# Altium schematic sheet [X] - mPCIe CONN.SchDoc
size 513 x 386 mm
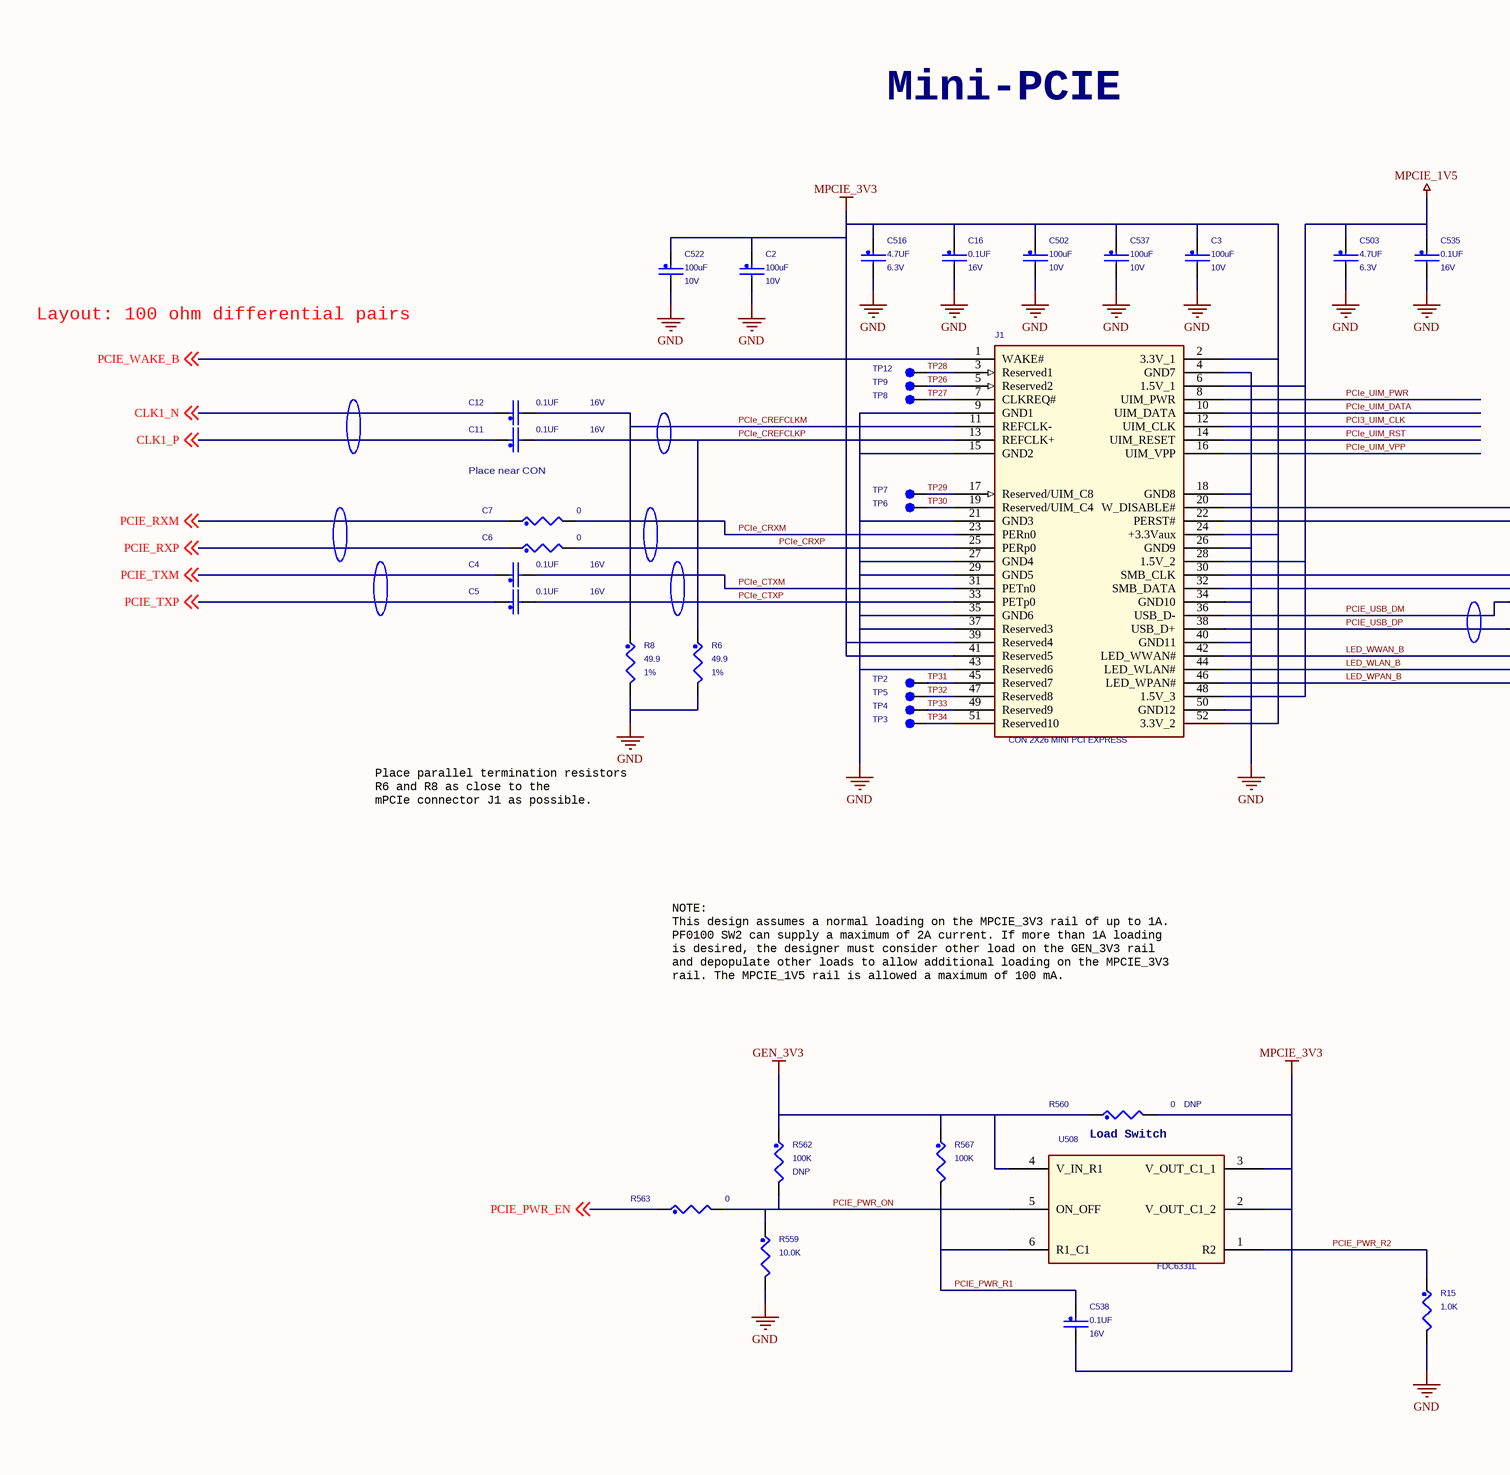
[diagram p0: [X] - mPCIe CONN.SchDoc, left]
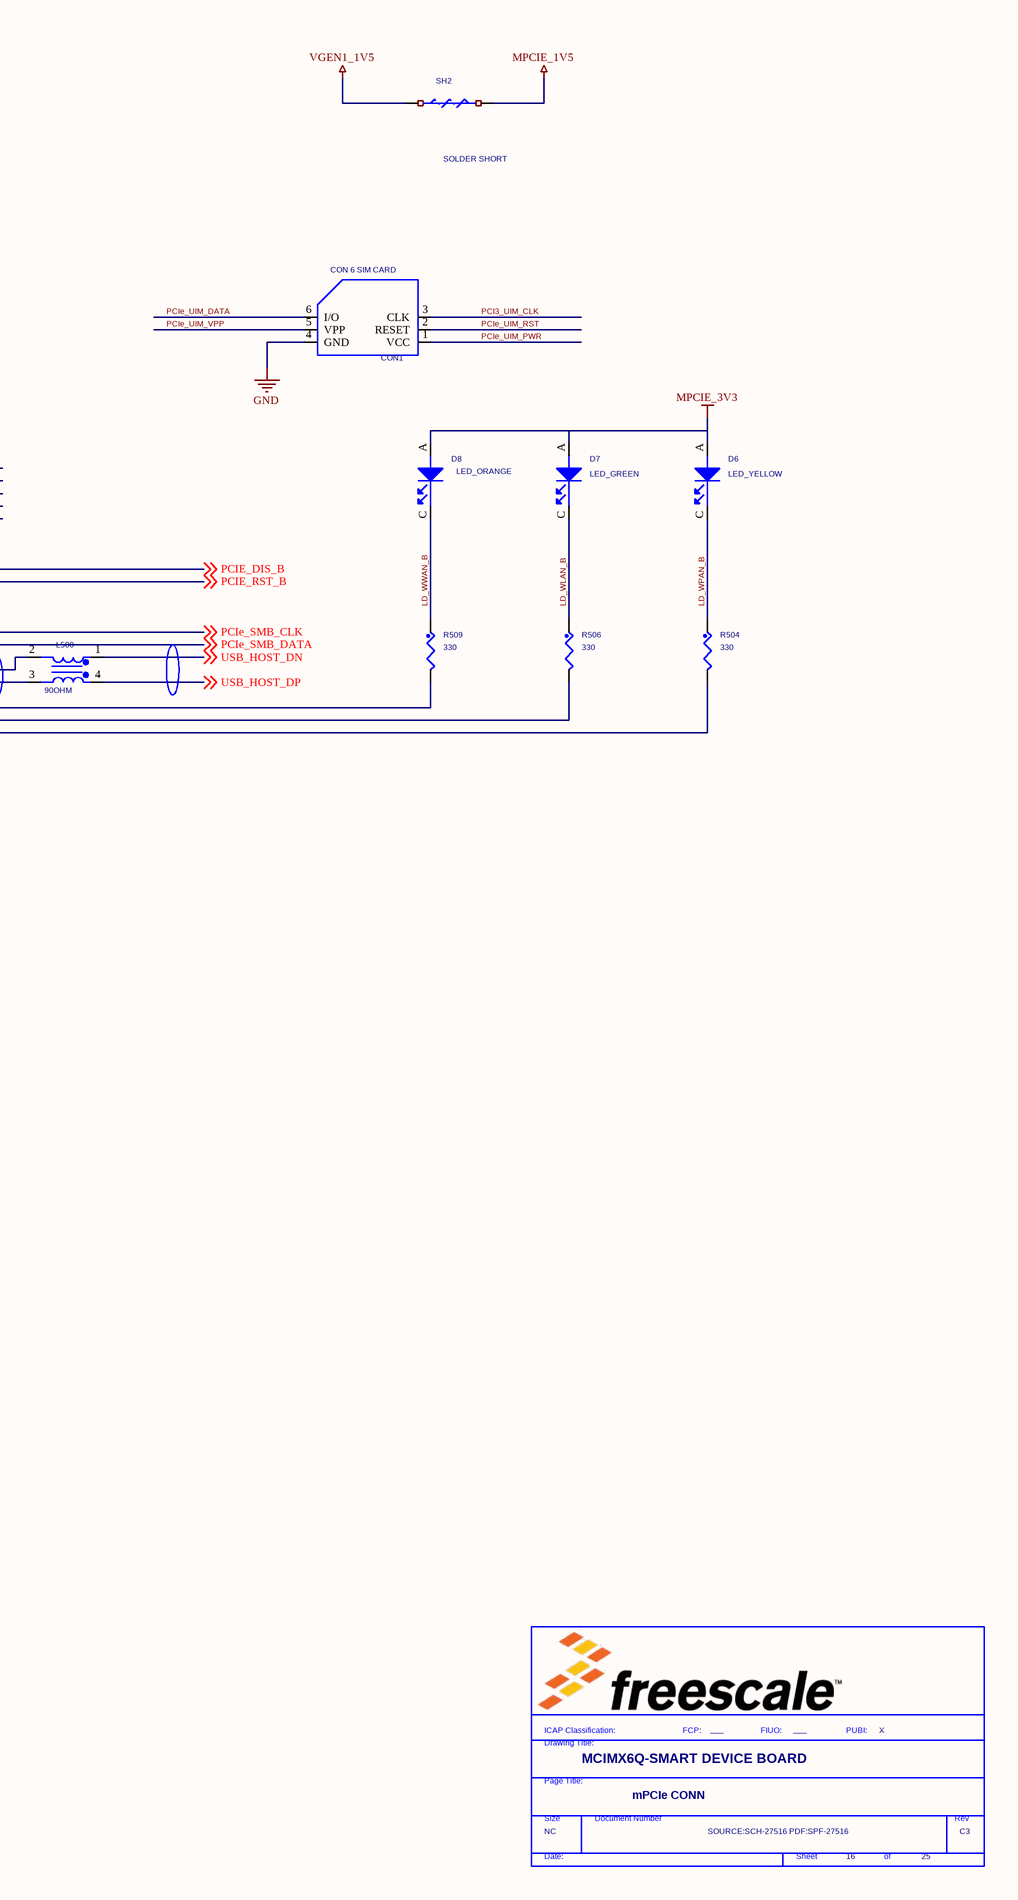
[diagram p1: [X] - mPCIe CONN.SchDoc, right]

## Parts
*  FIUO: ___  PUBI: X  Doc: SOURCE:SCH-27516 PDF:SPF-27516  RevCode: C3  Title: MCIMX6Q-SMART DEVICE BOARD  Page Size: NC  Page Number: 16  Page Count: 25  PageTitle: mPCIe CONN  (hidden comment: TitleBlock_FS)  (graphical)
C2  100uF  WVDC: 10V  [1206_CC]
C3  100uF  WVDC: 10V  [1206_CC]
C4  0.1UF  WVDC: 16V  [0402_CC]
C5  0.1UF  WVDC: 16V  [0402_CC]
C6  0  [0402_CC]
C7  0  [0402_CC]
C11  0.1UF  WVDC: 16V  [0402_CC]
C12  0.1UF  WVDC: 16V  [0402_CC]
C16  0.1UF  WVDC: 16V  [0402_CC]
C502  100uF  WVDC: 10V  [1206_CC]
C503  4.7UF  WVDC: 6.3V  [0603_CC]
C516  4.7UF  WVDC: 6.3V  [0603_CC]
C522  100uF  WVDC: 10V  [1206_CC]
C535  0.1UF  WVDC: 16V  [0402_CC]
C537  100uF  WVDC: 10V  [1206_CC]
C538  0.1UF  WVDC: 16V  [0402_CC]
CON1  CON 6 SIM CARD  [con_sim_cd_2p54mm]
D6  LED_YELLOW  [LED_0603]
D7  LED_GREEN  [LED_0603]
D8  LED_ORANGE  [LED_0603]
J1  CON 2X26 MINI PCI EXPRESS  [con_2x26_0p8_smt_a]
L500  90OHM  [ind4_choke_0805]
R6  49.9  Tolerance: 1%  [0402_CC]
R8  49.9  Tolerance: 1%  [0402_CC]
R15  1.0K  [0402_CC]
R504  330  [0402_CC]
R506  330  [0402_CC]
R509  330  [0402_CC]
R559  10.0K  [0402_CC]
R560  0  ASSY_OPT: DNP  [0402_CC]
R562  100K  ASSY_OPT: DNP  [0402_CC]
R563  0  [0402_CC]
R567  100K  [0402_CC]
SH2  SOLDER SHORT  [SH0805_40]
TP2  TEST POINT  [C035S]  (value not drawn)
TP3  TEST POINT  [C035S]  (value not drawn)
TP4  TEST POINT  [C035S]  (value not drawn)
TP5  TEST POINT  [C035S]  (value not drawn)
TP6  TEST POINT  [C035S]  (value not drawn)
TP7  TEST POINT  [C035S]  (value not drawn)
TP8  TEST POINT  [C035S]  (value not drawn)
TP9  TEST POINT  [C035S]  (value not drawn)
TP12  TEST POINT  [C035S]  (value not drawn)
U508  FDC6331L  [ssot6_1p7x3]

## Nets
GEN_3V3: R560.1 R562.1 R567.1 U508.4(V_IN_R1)
GND: C2.2 C3.2 C16.2 C502.2 C503.2 C516.2 C522.2 C535.2 C537.2 CON1.4(GND) J1.4(GND7) J1.9(GND1) J1.15(GND2) J1.18(GND8) J1.21(GND3) J1.26(GND9) J1.27(GND4) J1.29(GND5) J1.34(GND10) J1.35(GND6) J1.37(Reserved3) J1.40(GND11) J1.43(Reserved6) J1.50(GND12) R6.2 R8.2 R15.2 R559.2
MPCIE_1V5: C503.1 C535.1 J1.6(1.5V_1) J1.28(1.5V_2) J1.48(1.5V_3) SH2.2
MPCIE_3V3: C2.1 C3.1 C16.1 C502.1 C516.1 C522.1 C537.1 C538.2 D6.A(ANODE) D7.A(ANODE) D8.A(ANODE) J1.2(3.3V_1) J1.24(+3.3Vaux) J1.39(Reserved4) J1.41(Reserved5) J1.52(3.3V_2) R560.2 U508.2(V_OUT_C1_2) U508.3(V_OUT_C1_1)
VGEN1_1V5: SH2.1
CLK1_N: C12.1 ; off-sheet CLK1_N
CLK1_P: C11.1 ; off-sheet CLK1_P
LD_WLAN_B: D7.C(CATHODE) R506.1
LD_WPAN_B: D6.C(CATHODE) R504.1
LD_WWAN_B: D8.C(CATHODE) R509.1
LED_WLAN_B: J1.44(LED_WLAN#) R506.2
LED_WPAN_B: J1.46(LED_WPAN#) R504.2
LED_WWAN_B: J1.42(LED_WWAN#) R509.2
PCI3_UIM_CLK: CON1.3(CLK) J1.12(UIM_CLK)
PCIe_CREFCLKM: C12.2 J1.11(REFCLK-) R8.1
PCIe_CREFCLKP: C11.2 J1.13(REFCLK+) R6.1
PCIe_CRXM: C7.2 J1.23(PERn0)
PCIe_CRXP: C6.2 J1.25(PERp0)
PCIe_CTXM: C4.2 J1.31(PETn0)
PCIe_CTXP: C5.2 J1.33(PETp0)
PCIE_DIS_B: J1.20(W_DISABLE#) ; off-sheet PCIE_DIS_B
PCIE_PWR_EN: R563.1 ; off-sheet PCIE_PWR_EN
PCIE_PWR_ON: R559.1 R562.2 R563.2 U508.5(ON_OFF)
PCIE_PWR_R1: C538.1 R567.2 U508.6(R1_C1)
PCIE_PWR_R2: R15.1 U508.1(R2)
PCIE_RST_B: J1.22(PERST#) ; off-sheet PCIE_RST_B
PCIE_RXM: C7.1 ; off-sheet PCIE_RXM
PCIE_RXP: C6.1 ; off-sheet PCIE_RXP
PCIe_SMB_CLK: J1.30(SMB_CLK) ; off-sheet PCIe_SMB_CLK
PCIe_SMB_DATA: J1.32(SMB_DATA) ; off-sheet PCIe_SMB_DATA
PCIE_TXM: C4.1 ; off-sheet PCIE_TXM
PCIE_TXP: C5.1 ; off-sheet PCIE_TXP
PCIe_UIM_DATA: CON1.6(I/O) J1.10(UIM_DATA)
PCIe_UIM_PWR: CON1.1(VCC) J1.8(UIM_PWR)
PCIe_UIM_RST: CON1.2(RESET) J1.14(UIM_RESET)
PCIe_UIM_VPP: CON1.5(VPP) J1.16(UIM_VPP)
PCIE_USB_DM: J1.36(USB_D-) L500.2
PCIE_USB_DP: J1.38(USB_D+) L500.3
PCIE_WAKE_B: J1.1(WAKE#) ; off-sheet PCIE_WAKE_B
TP26: J1.5(Reserved2) TP9.1(Pin1)
TP27: J1.7(CLKREQ#) TP8.1(Pin1)
TP28: J1.3(Reserved1) TP12.1(Pin1)
TP29: J1.17(Reserved/UIM_C8) TP7.1(Pin1)
TP30: J1.19(Reserved/UIM_C4) TP6.1(Pin1)
TP31: J1.45(Reserved7) TP2.1(Pin1)
TP32: J1.47(Reserved8) TP5.1(Pin1)
TP33: J1.49(Reserved9) TP4.1(Pin1)
TP34: J1.51(Reserved10) TP3.1(Pin1)
USB_HOST_DN: L500.1 ; off-sheet USB_HOST_DN
USB_HOST_DP: L500.4 ; off-sheet USB_HOST_DP

## Notes on the sheet
- Mini-PCIE
- Layout: 100 ohm differential pairs
- Place near CON
- Place parallel termination resistors
  R6 and R8 as close to the
  mPCIe connector J1 as possible.
- NOTE:
  This design assumes a normal loading on the MPCIE_3V3 rail of up to 1A.
  PF0100 SW2 can supply a maximum of 2A current. If more than 1A loading
  is desired, the designer must consider other load on the GEN_3V3 rail
  and depopulate other loads to allow additional loading on the MPCIE_3V3
  rail. The MPCIE_1V5 rail is allowed a maximum of 100 mA.
- (near R560) Load Switch
- (in symbol TitleBlock_FS) ICAP Classification:; FCP:; FIUO:; PUBI:; Drawing Title:; Page Title:; Size; Document Number; Rev; Date:; Sheet; of

## Library data of the parts
* = TitleBlock_FS: OrgName: Freescale Semiconductor; OrgAddr1: 6501 William Cannon Drive West; OrgAddr2: Austin, TX 78735-8598; FCP: ___; Page Create Date: March  8, 1995
C2 C522 = CAP_NP: CAP CER 100uF 10V 20% X5R 1206; CLASS: DISCRETE; FPLIST: CC1206_OV,CC1206,1206_CC; CAD_APPROVED: Yes; MFG_PN01: C3216X5R1A107M; MFG_NAME01: TDK; AGILE_PN: 150-78880; HEIGHT: 1.9MM; ROHS: Yes; Tolerance: 20%; VOLTAGE: 10V
C3 C502 C537 = CAP_NP: CAP CER 100uF 10V 20% X5R 1206; CLASS: DISCRETE; SIGNAL_MODEL: DEFAULT_CAPACITOR_1e+08pF_2_1; FPLIST: CC1206_OV,CC1206,1206_CC; CAD_APPROVED: Yes; MFG_PN01: C3216X5R1A107M; MFG_NAME01: TDK; AGILE_PN: 150-78880; HEIGHT: 1.9MM; ROHS: Yes; Tolerance: 20%; VOLTAGE: 10V
C4 C5 = CAP_NP: CAP CER 0.1UF 16V 10% X7R 0402; CLASS: DISCRETE; SIGNAL_MODEL: DEFAULT_CAPACITOR_100000pF_2_1; PRIORITY_PN: 021-00196; FPLIST: CC0402_25,CC0402_HD,0402_CC; CAD_APPROVED: Yes; MFG_PN01: C0402C104K4RAC; MFG_NAME01: KEMET; AGILE_PN: 150-75182; ROOM: MINIPCIE; HEIGHT: 0.635MM; ROHS: Yes; Tolerance: 10%; VOLTAGE: 16V
C6 C7 = RES: RES MF ZERO OHM 1/10W -- 0402; CLASS: DISCRETE; AGILE_PN: 470-79965; MFG_NAME01: Panasonic; MFG_PN01: ERJ-2GE0R00X; CAD_APPROVED: Yes; FPLIST: RC0402_25,RC0402_HD,RC0402_X2,0402_CC; ROHS: Yes
C11 C535 = CAP_NP: CAP CER 0.1UF 16V 10% X7R 0402; CLASS: DISCRETE; SIGNAL_MODEL: DEFAULT_CAPACITOR_100000pF_2_1; AGILE_PN: 150-75182; MFG_NAME01: KEMET; MFG_PN01: C0402C104K4RAC; CAD_APPROVED: Yes; FPLIST: CC0402_25,CC0402_HD,0402_CC; PRIORITY_PN: 021-00196; ROOM: MINIPCIE; Tolerance: 10%; ROHS: Yes; HEIGHT: 0.635MM; VOLTAGE: 16V
C12 C16 = CAP_NP: CAP CER 0.1UF 16V 10% X7R 0402; CLASS: DISCRETE; SIGNAL_MODEL: DEFAULT_CAPACITOR_100000pF_2_1; ROOM: MINIPCIE; PRIORITY_PN: 021-00196; FPLIST: CC0402_25,CC0402_HD,0402_CC; CAD_APPROVED: Yes; MFG_PN01: C0402C104K4RAC; MFG_NAME01: KEMET; AGILE_PN: 150-75182; HEIGHT: 0.635MM; ROHS: Yes; Tolerance: 10%; VOLTAGE: 16V
C503 = CAP_NP: CAP CER 4.7UF 6.3V 10% X5R 0603; CLASS: DISCRETE; SIGNAL_MODEL: DEFAULT_CAPACITOR_4.7e+06pF_2_1; PRIORITY_PN: 021-00280; FPLIST: CC0603_OV,CC0603,0603_CC; CAD_APPROVED: Yes; MFG_PN01: C0603X5R6R3-475KNP; MFG_NAME01: VENKEL COMPANY; AGILE_PN: 150-75487; ROOM: MINIPCIE; HEIGHT: 1.016MM; ROHS: Yes; Tolerance: 10%; VOLTAGE: 6.3V
C516 = CAP_NP: CAP CER 4.7UF 6.3V 10% X5R 0603; CLASS: DISCRETE; SIGNAL_MODEL: DEFAULT_CAPACITOR_4.7e+06pF_2_1; ROOM: MINIPCIE; AGILE_PN: 150-75487; MFG_NAME01: VENKEL COMPANY; MFG_PN01: C0603X5R6R3-475KNP; CAD_APPROVED: Yes; FPLIST: CC0603_OV,CC0603,0603_CC; PRIORITY_PN: 021-00280; Tolerance: 10%; ROHS: Yes; HEIGHT: 1.016MM; VOLTAGE: 6.3V
C538 = CAP_NP: CAP CER 0.1UF 16V 10% X7R 0402; CLASS: DISCRETE; FPLIST: CC0402_25,CC0402_HD,0402_CC; CAD_APPROVED: Yes; MFG_PN01: C0402C104K4RAC; MFG_NAME01: KEMET; AGILE_PN: 150-75182; SIGNAL_MODEL: DEFAULT_CAPACITOR_100000pF_2_1; HEIGHT: 0.635MM; ROHS: Yes; Tolerance: 10%; VOLTAGE: 16V
CON1 = SF7W006S1A: CON 6 SIM CARD SMT 100MIL SP 91H AU; CLASS: IO; AGILE_PN: 211-78718; MFG_NAME01: JAE; MFG_PN01: SF7W006S1AE1000; CAD_APPROVED: Yes; ROHS: Yes; HEIGHT: 2.35MM
D6 = LED: LED ULTRA-BRIGHT YELLOW 30MA 5V SMT 0603; CLASS: IC; AGILE_PN: 370-75076; MFG_NAME01: LITE ON; MFG_PN01: LTST-C190KSKT; CAD_APPROVED: Yes; ROHS: Yes; HEIGHT: 0.8MM
D7 = LED: LED ULTRA-BRIGHT GREEN SMT 0603; CLASS: IC; CAD_APPROVED: YES; MFG_PN01: LTST-C190KGKT; MFG_NAME01: LITE ON; AGILE_PN: 370-75077; HEIGHT: 0.8MM; ROHS: Yes
D8 = LED: LED SUPER BRIGHT ORANGE SMD 0603; CLASS: IC; AGILE_PN: 370-75145; MFG_NAME01: KINGBRIGHT; MFG_PN01: AP1608SEC; CAD_APPROVED: Yes; ROHS: Yes; HEIGHT: 1.1mm
J1 = MINI_PCI_LATCH_52P: CON 2X26 MINI PCI EXPRESS SMT 0.8MM SP 1136H; CLASS: IO; AGILE_PN: 211-78711; MFG_NAME01: Molex; MFG_PN01: 679100002; CAD_APPROVED: Yes; ROHS: Yes; HEIGHT: 28.85MM
L500 = DLW43: IND CHK 90 OHM@100MHZ 330MA 25% 0805; PART_TYPE: CHOKE; CLASS: DISCRETE; AGILE_PN: 180-76336; MFG_NAME01: MURATA; MFG_PN01: DLW21HN900SQ2L; CAD_APPROVED: Yes; Tolerance: 25%; ROHS: Yes; HEIGHT: 1MM
R6 R8 = RES: RES MF 49.9 OHM 1/16W 1% 0402; CLASS: DISCRETE; SIGNAL_MODEL: DEFAULT_RESISTOR_49.9OHM_2_1; AGILE_PN: 470-75360; MFG_NAME01: KOA SPEER; MFG_PN01: RK73H1ETTP49R9F; CAD_APPROVED: Yes; FPLIST: RC0402_25,RC0402_HD,0402_CC; ROHS: Yes
R15 = RES: RES MF 1.0K 1/16W 1% 0402; CLASS: DISCRETE; FPLIST: RC0402_25,RC0402_HD,RC0402_X2,0402_CC; PRIORITY_PN: 006-00553; CAD_APPROVED: Yes; MFG_PN01: RK73H1ETTP1001F; MFG_NAME01: KOA SPEER; AGILE_PN: 470-76037; ROOM: USB_CON; SIGNAL_MODEL: DEFAULT_RESISTOR_1000OHM_2_1; ROHS: Yes; Tolerance: 1%
R504 R506 = RES: RES MF 330 OHM 1/16W 1% 0402; CLASS: DISCRETE; SIGNAL_MODEL: DEFAULT_RESISTOR_330OHM_2_1; FPLIST: RC0402_25,RC0402_HD,0402_CC; CAD_APPROVED: Yes; MFG_PN01: CRCW0402330RFK; MFG_NAME01: VISHAY INTERTECHNOLOGY; AGILE_PN: 470-76465; ROHS: Yes; Tolerance: 1%
R509 = RES: RES MF 330 OHM 1/16W 1% 0402; CLASS: DISCRETE; SIGNAL_MODEL: DEFAULT_RESISTOR_330OHM_2_1; AGILE_PN: 470-76465; MFG_NAME01: VISHAY INTERTECHNOLOGY; MFG_PN01: CRCW0402330RFK; CAD_APPROVED: Yes; FPLIST: RC0402_25,RC0402_HD,0402_CC; Tolerance: 1%; ROHS: Yes
R559 = RES: RES MF 10.0K 1/16W 1% 0402; CLASS: DISCRETE; AGILE_PN: 470-75416; MFG_NAME01: VISHAY INTERTECHNOLOGY; MFG_PN01: CRCW040210K0FKED; CAD_APPROVED: Yes; FPLIST: RC0402_25,RC0402_HD,0402_CC; SIGNAL_MODEL: DEFAULT_RESISTOR_10000OHM_2_1; Tolerance: 1%; ROHS: Yes
R560 = RES: RES MF ZERO OHM 1/10W -- 0402; CLASS: DISCRETE; ROOM: ATLAS-AP; FPLIST: RC0402_25,RC0402_HD,RC0402_X2,0402_CC; AGILE_PN: 470-79965; MFG_NAME01: Panasonic; MFG_PN01: ERJ-2GE0R00X; CAD_APPROVED: Yes; PRIORITY_PN: 006-00441; SIGNAL_MODEL: DEFAULT_RESISTOR_0.001OHM_2_1; ROHS: Yes
R562 = RES: RES MF 100K 1/16W 1% 0402; CLASS: DISCRETE; PRIORITY_PN: 006-00657; FPLIST: RC0402_25,rc0402_frs; CAD_APPROVED: Yes; MFG_PN01: RK73H1ETTP1003F; MFG_NAME01: KOA SPEER; AGILE_PN: 470-76240; ROOM: USB_CON; SIGNAL_MODEL: DEFAULT_RESISTOR_100000OHM_2_1; Tolerance: 1%; ROHS: Yes
R563 = RES: RES MF ZERO OHM 1/10W -- 0402; CLASS: DISCRETE; PRIORITY_PN: 006-00559; FPLIST: RC0402_25,RC0402_HD,RC0402_X2,0402_CC; CAD_APPROVED: Yes; MFG_PN01: ERJ-2GE0R00X; MFG_NAME01: Panasonic; AGILE_PN: 470-79965; ROOM: RGMII_PHY; SIGNAL_MODEL: DEFAULT_RESISTOR_0.001OHM_2_1; ROHS: Yes
R567 = RES: RES MF 100K 1/16W 1% 0402; CLASS: DISCRETE; ROOM: USB_CON; AGILE_PN: 470-76240; MFG_NAME01: KOA SPEER; MFG_PN01: RK73H1ETTP1003F; CAD_APPROVED: Yes; FPLIST: RC0402_25,rc0402_frs; PRIORITY_PN: 006-00657; SIGNAL_MODEL: DEFAULT_RESISTOR_100000OHM_2_1; ROHS: Yes; Tolerance: 1%
SH2 = RES_SHORT-2: SOLDER SHORT 0805  SMT NO PART TO ORDER; CLASS: DISCRETE; AGILE_PN: 470-80202; MFG_NAME01: NOTACOMPONENT; MFG_PN01: SOLDER_SHORT_0805; ASSY_OPT: DNP; CAD_APPROVED: Yes; FPLIST: SH0805,SH0805CUST,SH0805_40; ROHS: Yes
TP2-TP8 = Test pad: TEST POINT PAD 35 MIL SMT, NO PART TO ORDER; CLASS: IC; AGILE_PN: 280-75148; MFG_NAME01: NA; ASSY_OPT: DNP; CAD_APPROVED: Yes; MFG_PN01: NA; ROHS: Yes; HEIGHT: 0.1 MM
TP9 TP12 = Test pad: TEST POINT PAD 35 MIL SMT, NO PART TO ORDER; CLASS: IC; CAD_APPROVED: Yes; ASSY_OPT: DNP; MFG_PN01: NA; AGILE_PN: 280-75148; HEIGHT: 0.1 MM; ROHS: Yes; MFG_NAME01: NA
U508 = FDC6331L: IC LOAD SW 2.5-8V SSOT6; CAD_APPROVED: Yes; MFG_NAME01: Fairchild; AGILE_PN: 315-78829; PRIORITY_PN: 051-FDC6331L; CLASS: IC; HEIGHT: 1.1MM; ROHS: Yes; MFG_PN01: FDC6331L